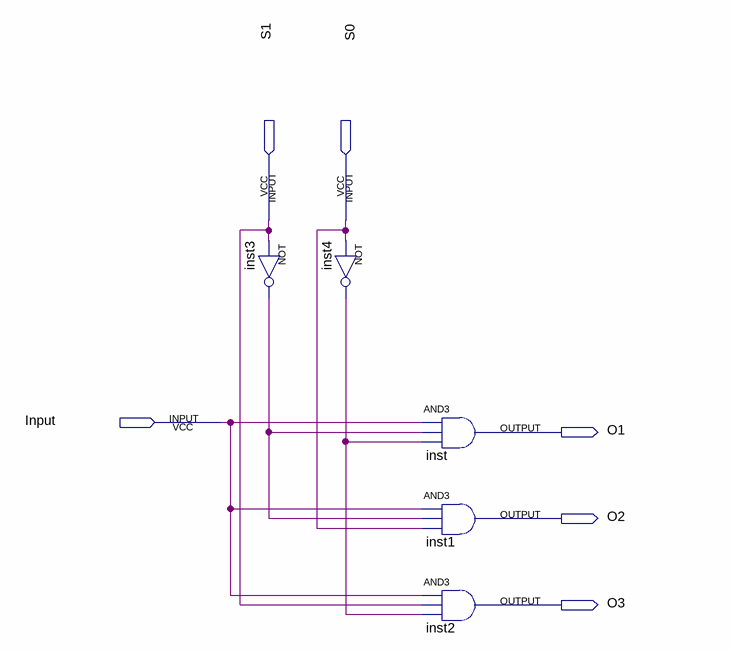
[diagram p0: schematic sheet]
// Quartus schematic threeonedemux.bdf as structural Verilog: 5 symbols, 6 pins
module threeonedemux (
  input  S1,
  input  S0,
  input  Input,
  output O1,
  output O2,
  output O3
);

  wire inst3_out, inst4_out;

  not inst3 (inst3_out, S1);
  not inst4 (inst4_out, S0);
  and inst (O1, Input, inst3_out, inst4_out);
  and inst1 (O2, Input, inst3_out, S0);
  and inst2 (O3, Input, S1, inst4_out);
endmodule
